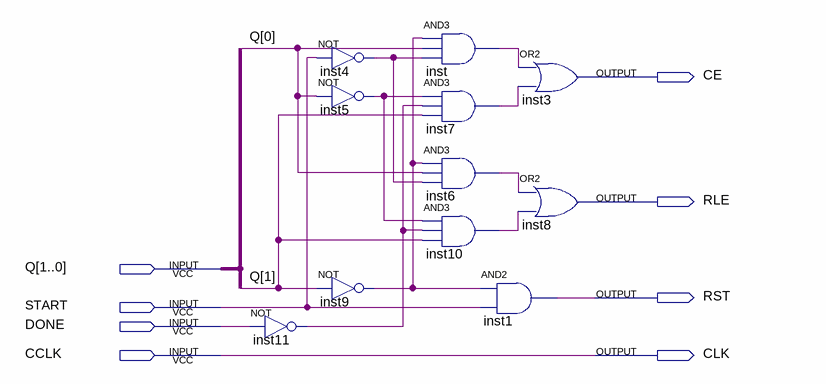
[diagram p0: schematic sheet]
// Quartus schematic OutputLogic.bdf as structural Verilog: 11 symbols, 8 pins
module OutputLogic (
  input  [1:0] Q,
  input  START,
  input  DONE,
  input  CCLK,
  output CE,
  output RLE,
  output RST,
  output CLK
);

  wire inst4_out, inst5_out, inst6_out, inst7_out, inst9_out, inst10_out, inst11_out, inst_out;

  not inst11 (inst11_out, DONE);
  not inst4 (inst4_out, START);
  not inst5 (inst5_out, Q[0]);
  not inst9 (inst9_out, Q[1]);
  and inst (inst_out, inst9_out, Q[0], inst4_out);
  and inst7 (inst7_out, inst5_out, inst11_out, Q[1]);
  and inst6 (inst6_out, inst9_out, Q[0], inst4_out);
  and inst10 (inst10_out, inst5_out, inst11_out, Q[1]);
  and inst1 (RST, inst9_out, START);
  or inst3 (CE, inst_out, inst7_out);
  or inst8 (RLE, inst6_out, inst10_out);

  assign CLK = CCLK;
endmodule
